# Altium schematic sheet STM32H730_PINOUT.SchDoc
size C; SheetNumber: 4; SheetTotal: 15
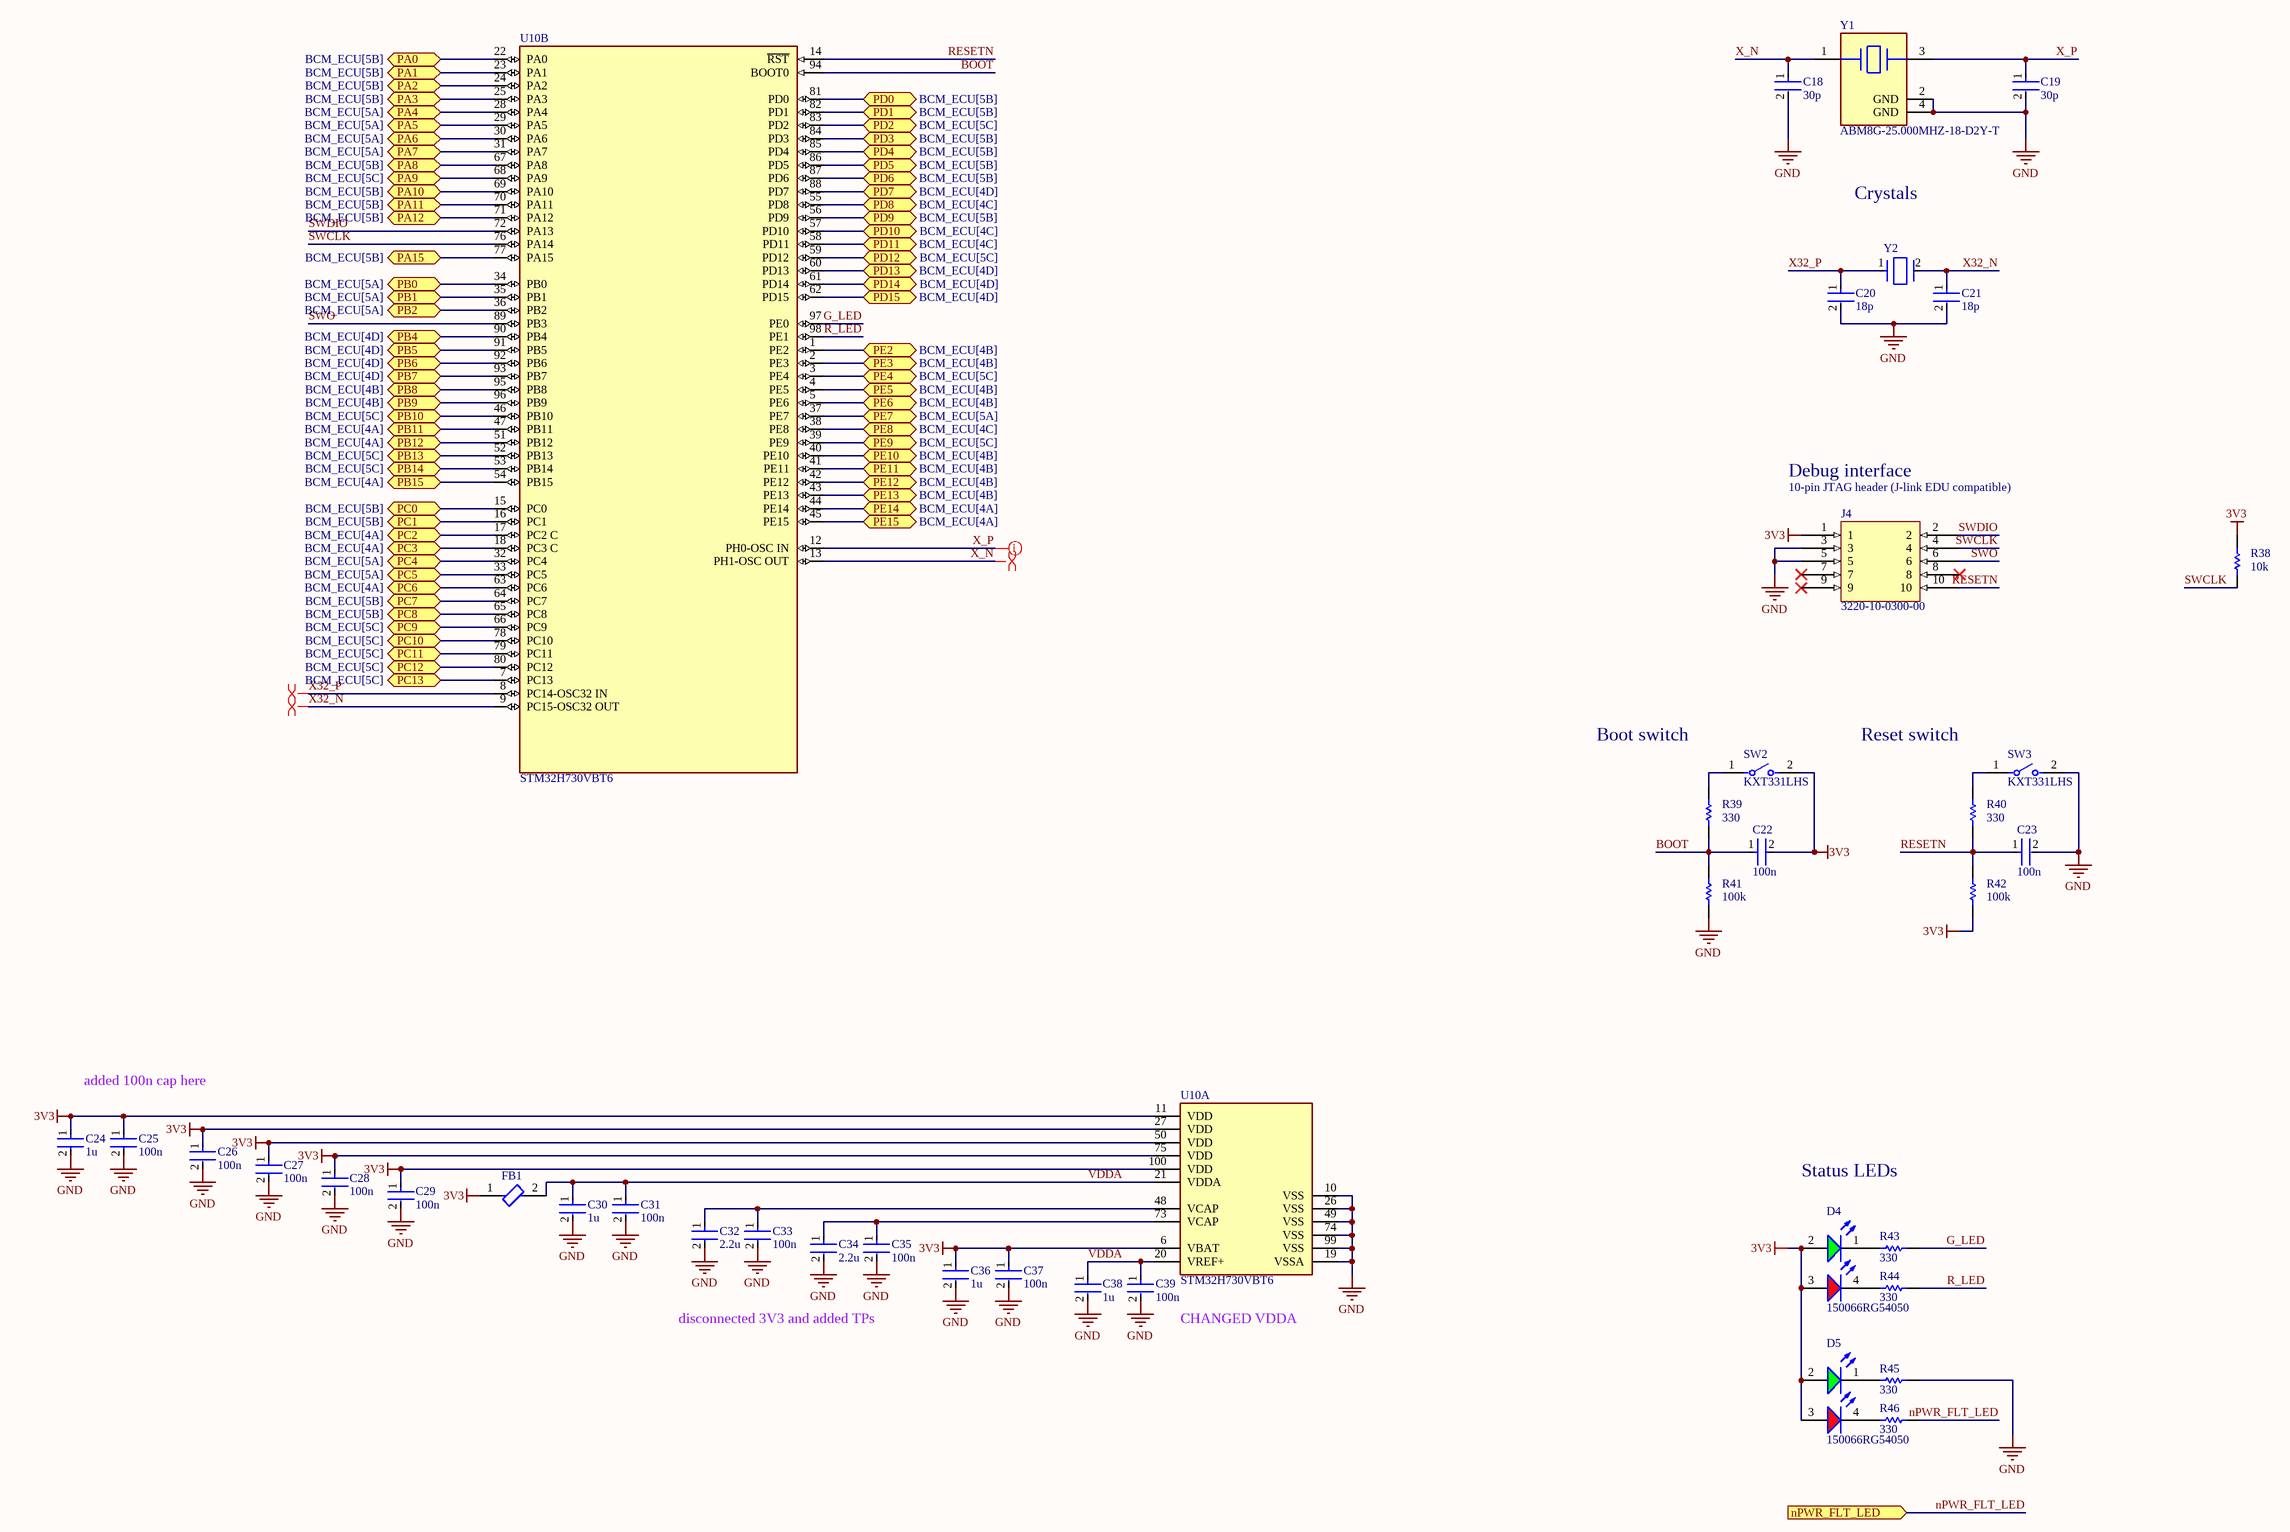
[diagram p0: STM32H730_PINOUT.SchDoc]

## Parts
C18  30p  [FP-0402-L_1_0_0_05-W_0_5-IPC_A]
C19  30p  [FP-0402-L_1_0_0_05-W_0_5-IPC_A]
C20  18p  [FP-0402-L_1_0_0_05-W_0_5-IPC_A]
C21  18p  [FP-0402-L_1_0_0_05-W_0_5-IPC_A]
C22  100n  [FP-0402-L_1_0_0_05-W_0_5-IPC_A]
C23  100n  [FP-0402-L_1_0_0_05-W_0_5-IPC_A]
C24  1u  [FP-0402-L_1_0_0_05-W_0_5-IPC_A]
C25  100n  [FP-0402-L_1_0_0_05-W_0_5-IPC_A]
C26  100n  [FP-0402-L_1_0_0_05-W_0_5-IPC_A]
C27  100n  [FP-0402-L_1_0_0_05-W_0_5-IPC_A]
C28  100n  [FP-0402-L_1_0_0_05-W_0_5-IPC_A]
C29  100n  [FP-0402-L_1_0_0_05-W_0_5-IPC_A]
C30  1u  [FP-0402-L_1_0_0_05-W_0_5-IPC_A]
C31  100n  [FP-0402-L_1_0_0_05-W_0_5-IPC_A]
C32  2.2u  [FP-0402-L_1_0_0_05-W_0_5-IPC_A]
C33  100n  [FP-0402-L_1_0_0_05-W_0_5-IPC_A]
C34  2.2u  [FP-0402-L_1_0_0_05-W_0_5-IPC_A]
C35  100n  [FP-0402-L_1_0_0_05-W_0_5-IPC_A]
C36  1u  [FP-0402-L_1_0_0_05-W_0_5-IPC_A]
C37  100n  [FP-0402-L_1_0_0_05-W_0_5-IPC_A]
C38  1u  [FP-0402-L_1_0_0_05-W_0_5-IPC_A]
C39  100n  [FP-0402-L_1_0_0_05-W_0_5-IPC_A]
D4  150066RG54050  [WL-SBCD_0606]
D5  150066RG54050  [WL-SBCD_0606]
FB1  BLM15PX601SN1D  [FP-BLM15-0_05-IPC_A]  (value not drawn)
J4  3220-10-0300-00  [3220-10-0300-00-Footprint-1]
R38  10k  [R0603B]
R39  330  [R0603B]
R40  330  [R0603B]
R41  100k  [R0603B]
R42  100k  [R0603B]
R43  330  [R0603B]
R44  330  [R0603B]
R45  330  [R0603B]
R46  330  [R0603B]
SW2  KXT331LHS  [FP-KXT331LHS-MFG]
SW3  KXT331LHS  [FP-KXT331LHS-MFG]
U10  STM32H730VBT6  [FP-LQFP100-1L-IPC_C]  (parts A,B of 2)
Y1  ABM8G-25.000MHZ-18-D2Y-T  [FP-ABM8G-MFG]
Y2  ECS-.327-12.5-1210-TR  [FP-ECX-1210-MFG]  (value not drawn)

## Ports
nPWR_FLT_LED (in), PA0 (bidir, see BCM_ECU[5B]), PA1 (bidir, see BCM_ECU[5B]), PA2 (bidir, see BCM_ECU[5B]), PA3 (bidir, see BCM_ECU[5B]), PA4 (bidir, see BCM_ECU[5A]), PA5 (bidir, see BCM_ECU[5A]), PA6 (bidir, see BCM_ECU[5A]), PA7 (bidir, see BCM_ECU[5A]), PA8 (bidir, see BCM_ECU[5B]), PA9 (bidir, see BCM_ECU[5C]), PA10 (bidir, see BCM_ECU[5B]), PA11 (bidir, see BCM_ECU[5B]), PA12 (bidir, see BCM_ECU[5B]), PA15 (bidir, see BCM_ECU[5B]), PB0 (bidir, see BCM_ECU[5A]), PB1 (bidir, see BCM_ECU[5A]), PB2 (bidir, see BCM_ECU[5A]), PB4 (bidir, see BCM_ECU[4D]), PB5 (bidir, see BCM_ECU[4D]), PB6 (bidir, see BCM_ECU[4D]), PB7 (bidir, see BCM_ECU[4D]), PB8 (bidir, see BCM_ECU[4B]), PB9 (bidir, see BCM_ECU[4B]), PB10 (bidir, see BCM_ECU[5C]), PB11 (bidir, see BCM_ECU[4A]), PB12 (bidir, see BCM_ECU[4A]), PB13 (bidir, see BCM_ECU[5C]), PB14 (bidir, see BCM_ECU[5C]), PB15 (bidir, see BCM_ECU[4A]), PC0 (bidir, see BCM_ECU[5B]), PC1 (bidir, see BCM_ECU[5B]), PC2 (bidir, see BCM_ECU[4A]), PC3 (bidir, see BCM_ECU[4A]), PC4 (bidir, see BCM_ECU[5A]), PC5 (bidir, see BCM_ECU[5A]), PC6 (bidir, see BCM_ECU[4A]), PC7 (bidir, see BCM_ECU[5B]), PC8 (bidir, see BCM_ECU[5B]), PC9 (bidir, see BCM_ECU[5C]), PC10 (bidir, see BCM_ECU[5C]), PC11 (bidir, see BCM_ECU[5C]), PC12 (bidir, see BCM_ECU[5C]), PC13 (bidir, see BCM_ECU[5C]), PD0 (bidir, see BCM_ECU[5B]), PD1 (bidir, see BCM_ECU[5B]), PD2 (bidir, see BCM_ECU[5C]), PD3 (bidir, see BCM_ECU[5B]), PD4 (bidir, see BCM_ECU[5B]), PD5 (bidir, see BCM_ECU[5B]), PD6 (bidir, see BCM_ECU[5B]), PD7 (bidir, see BCM_ECU[4D]), PD8 (bidir, see BCM_ECU[4C]), PD9 (bidir, see BCM_ECU[5B]), PD10 (bidir, see BCM_ECU[4C]), PD11 (bidir, see BCM_ECU[4C]), PD12 (bidir, see BCM_ECU[5C]), PD13 (bidir, see BCM_ECU[4D]), PD14 (bidir, see BCM_ECU[4D]), PD15 (bidir, see BCM_ECU[4D]), PE2 (bidir, see BCM_ECU[4B]), PE3 (bidir, see BCM_ECU[4B]), PE4 (bidir, see BCM_ECU[5C]), PE5 (bidir, see BCM_ECU[4B]), PE6 (bidir, see BCM_ECU[4B]), PE7 (bidir, see BCM_ECU[5A]), PE8 (bidir, see BCM_ECU[4C]), PE9 (bidir, see BCM_ECU[5C]), PE10 (bidir, see BCM_ECU[4B]), PE11 (bidir, see BCM_ECU[4B]), PE12 (bidir, see BCM_ECU[4B]), PE13 (bidir, see BCM_ECU[4B]), PE14 (bidir, see BCM_ECU[4A]), PE15 (bidir, see BCM_ECU[4A])

## Nets
3V3: C22.2 C24.1 C25.1 C26.1 C27.1 C28.1 C29.1 C36.1 C37.1 D4.2(A) D4.3(A) D5.2(A) D5.3(A) FB1.1 J4.1 R38.2 R42.1 SW2.2 U10.6(VBAT) U10.11(VDD) U10.27(VDD) U10.50(VDD) U10.75(VDD) U10.100(VDD)
GND: C18.2 C19.2 C20.2 C21.2 C23.2 C24.2 C25.2 C26.2 C27.2 C28.2 C29.2 C30.2 C31.2 C32.2 C33.2 C34.2 C35.2 C36.2 C37.2 C38.2 C39.2 J4.3 J4.5 R41.1 R45.1 SW3.2 U10.10(VSS) U10.19(VSSA) U10.26(VSS) U10.49(VSS) U10.74(VSS) U10.99(VSS) Y1.2(GND) Y1.4(GND)
BOOT: C22.1 R39.1 R41.2 U10.94(BOOT0)
G_LED: R43.1 U10.97(PE0)
nPWR_FLT_LED: R46.1 ; port nPWR_FLT_LED
PA0: U10.22(PA0) ; port PA0
PA1: U10.23(PA1) ; port PA1
PA2: U10.24(PA2) ; port PA2
PA3: U10.25(PA3) ; port PA3
PA4: U10.28(PA4) ; port PA4
PA5: U10.29(PA5) ; port PA5
PA6: U10.30(PA6) ; port PA6
PA7: U10.31(PA7) ; port PA7
PA8: U10.67(PA8) ; port PA8
PA9: U10.68(PA9) ; port PA9
PA10: U10.69(PA10) ; port PA10
PA11: U10.70(PA11) ; port PA11
PA12: U10.71(PA12) ; port PA12
PA15: U10.77(PA15) ; port PA15
PB0: U10.34(PB0) ; port PB0
PB1: U10.35(PB1) ; port PB1
PB2: U10.36(PB2) ; port PB2
PB4: U10.90(PB4) ; port PB4
PB5: U10.91(PB5) ; port PB5
PB6: U10.92(PB6) ; port PB6
PB7: U10.93(PB7) ; port PB7
PB8: U10.95(PB8) ; port PB8
PB9: U10.96(PB9) ; port PB9
PB10: U10.46(PB10) ; port PB10
PB11: U10.47(PB11) ; port PB11
PB12: U10.51(PB12) ; port PB12
PB13: U10.52(PB13) ; port PB13
PB14: U10.53(PB14) ; port PB14
PB15: U10.54(PB15) ; port PB15
PC0: U10.15(PC0) ; port PC0
PC1: U10.16(PC1) ; port PC1
PC2: U10.17(PC2_C) ; port PC2
PC3: U10.18(PC3_C) ; port PC3
PC4: U10.32(PC4) ; port PC4
PC5: U10.33(PC5) ; port PC5
PC6: U10.63(PC6) ; port PC6
PC7: U10.64(PC7) ; port PC7
PC8: U10.65(PC8) ; port PC8
PC9: U10.66(PC9) ; port PC9
PC10: U10.78(PC10) ; port PC10
PC11: U10.79(PC11) ; port PC11
PC12: U10.80(PC12) ; port PC12
PC13: U10.7(PC13) ; port PC13
PD0: U10.81(PD0) ; port PD0
PD1: U10.82(PD1) ; port PD1
PD2: U10.83(PD2) ; port PD2
PD3: U10.84(PD3) ; port PD3
PD4: U10.85(PD4) ; port PD4
PD5: U10.86(PD5) ; port PD5
PD6: U10.87(PD6) ; port PD6
PD7: U10.88(PD7) ; port PD7
PD8: U10.55(PD8) ; port PD8
PD9: U10.56(PD9) ; port PD9
PD10: U10.57(PD10) ; port PD10
PD11: U10.58(PD11) ; port PD11
PD12: U10.59(PD12) ; port PD12
PD13: U10.60(PD13) ; port PD13
PD14: U10.61(PD14) ; port PD14
PD15: U10.62(PD15) ; port PD15
PE2: U10.1(PE2) ; port PE2
PE3: U10.2(PE3) ; port PE3
PE4: U10.3(PE4) ; port PE4
PE5: U10.4(PE5) ; port PE5
PE6: U10.5(PE6) ; port PE6
PE7: U10.37(PE7) ; port PE7
PE8: U10.38(PE8) ; port PE8
PE9: U10.39(PE9) ; port PE9
PE10: U10.40(PE10) ; port PE10
PE11: U10.41(PE11) ; port PE11
PE12: U10.42(PE12) ; port PE12
PE13: U10.43(PE13) ; port PE13
PE14: U10.44(PE14) ; port PE14
PE15: U10.45(PE15) ; port PE15
R_LED: R44.1 U10.98(PE1)
RESETN: C23.1 J4.10 R40.1 R42.2 U10.14(~{RST})
SWCLK: J4.4 R38.1 U10.76(PA14)
SWDIO: J4.2 U10.72(PA13)
SWO: J4.6 U10.89(PB3)
VDDA: C30.1 C31.1 C38.1 C39.1 FB1.2 U10.20(VREF+) U10.21(VDDA)
X32_N: C21.1 U10.9(PC15-OSC32_OUT) Y2.2(Out/In)
X32_P: C20.1 U10.8(PC14-OSC32_IN) Y2.1(In/Out)
X_N: C18.1 U10.13(PH1-OSC_OUT) Y1.1
X_P: C19.1 U10.12(PH0-OSC_IN) Y1.3
NetC32_1: C32.1 C33.1 U10.48(VCAP)
NetC34_1: C34.1 C35.1 U10.73(VCAP)
NetD4_1: D4.1(K) R43.2
NetD4_4: D4.4(K) R44.2
NetD5_1: D5.1(K) R45.2
NetD5_4: D5.4(K) R46.2
NetR39_2: R39.2 SW2.1
NetR40_2: R40.2 SW3.1

Not connected (* = marked no-connect by the designer): J4 7* 8* 9*

## Layout directives
differential pair: X32_N, X32_P, X_N, X_P

## Notes on the sheet
- Crystals
- Debug interface
- (near J4) 10-pin JTAG header (J-link EDU compatible)
- Boot switch
- Reset switch
- added 100n cap here
- Status LEDs
- disconnected 3V3 and added TPs
- CHANGED VDDA

## Library data of the parts
C18-C39 = CMP-001-00058-1: LARGE PADS, 0402 CAP, CHANGE COMMENT TO MATCH REAL P/N; Capacitor Type: Ceramic; Min Operating Temperature: -55°C; Mounting Technology: Surface Mount; Pins: 2; Case/Package: 0402; RoHS Compliant: Yes; Max Operating Temperature: 85°C
D4 D5 = CMP-004-00040-2: Led, Red/Grn, 180Mcd/230Mcd, 624Nm/525Nm Rohs Compliant: Yes; Source: rgled.SchLib; Component Type: Standard; Design Item ID: CMP-004-00034-2; Pins: 4
FB1 = CMP-0686-00252-4: Chip Ferrite Bead, 0402, 600Ω @ 100MHz, 0.23Ω, 25%, 900mA; Number of Circuits: 1; Impedance: 600R; DC Resistance (DCR): 230mR; Material: Steel; Length: 1mm; Package Quantity: 10000; Height: 0.5mm; Width: 0.5mm; Max DC Current: 900mA; Number of Lines: 1; Termination: SMD/SMT; Packaging: Tape and Reel; Lead Free: Lead Free; Min Operating Temperature: -55°C; Max Operating Temperature: 125°C; Max Current Rating: 900mA; Case Code (Imperial): 0402; Number of Pins: 2; Current Rating: 900mA; Test Frequency: 100MHz; Case/Package: 0402; Tolerance: 25%; Case Code (Metric): 1005
J4 = CMP-001-0013-3: CONN HEADER SMD 10POS 1.27MM
R38-R40 R43-R46 = CMP-009-00002-14: Resistor
  R38: Value: 10k
  R39 R40 R43-R46: Value: 330
R41 R42 = CMP-009-00002-14: Resistor; Value: 10k
SW2 SW3 = CMP-10040-000029-1: SWITCH TACTILE SPST-NO 0.02A 15V; Operating Force: 240gf; Switch Travel: 0.13mm; Illumination Type: Non-Illuminated; Throw Configuration: SPST; Number of Ports: 1; Current Rating: 5A; Mechanical Life: 500000Cycles; Switch Function: Off-Mom; Connector Type: USB; Actuator Type: Standard; Gender: Receptacle; Number of Contacts: 24; Contact Plating: Gold; Insulation Color: Black; Min Operating Temperature: -40°C; Packaging: Tape and Reel; Flammability Rating: UL94 V-0; Max Operating Temperature: 85°C; Termination: Solder; Mount: Surface Mount
U10 = CMP-12105-000107-1: IC MCU 32BIT 128KB FLASH 100LQFP
Y1 = CMP-2000-05733-3: Crystal 25MHz ±20ppm (Tol) ±30ppm (Stability) 18pF FUND 60Ω 4-Pin SMD T/R; Series Resistance: 60R; Length: 3.2mm; Depth: 2.5mm; Packaging: Tape and Reel; Min Operating Temperature: -40°C; Operating Frequency: 25 MHz; Lead Free: Lead Free; Number of Pins: 4; Frequency Tolerance: 20ppm; Radiation Hardening: No; Max Operating Temperature: 85°C; Termination: SMD/SMT; Frequency Stability: 30ppm; Frequency: 25MHz; Series: ABM8G; Mount: Surface Mount; Package Quantity: 1000; Height: 0.039inch; Width: 0.098inch; Case/Package: CSMD; ESR (Equivalent Series Resistance): 60R; Load Capacitance: 18pF; Tolerance: 20ppm
Y2 = CMP-40224-000006-1: CRYSTAL 32.7680KHZ 12.5PF SMD; Manufacturer: ECS International; Frequency: 32.768kHz; Esr: 90kΩ; Tolerance: 20ppm; Device Class L1: Passive Components; Load Capacitance: 12.5pF; Temperature: -40°C to +85°C; ComponentLink2URL: https://ecsxtal.com/store/pdf/ECX-1210.pdf; Series: ECX-1210; Octopart: https://octopart.com/ecs-.327-12.5-1210-tr-ecs+international-81221340; ComponentLink2Description: Datasheet; Temperature Range Low: -40°C; Digikey Description: CRYSTAL 32.7680KHZ 12.5PF SMD; Lead Free: Yes; RoHS: TRUE; Device Class L3: Crystals; Automotive: No; Category: Crys; Height: 0.5mm; Manufacturer Part Number: ECS-.327-12.5-1210-TR; Temperature Range High: +85°C; Device Class L2: Crystals / Oscillators; Package: ECX-1210